# Altium project Discharge_circuit.PrjPcb
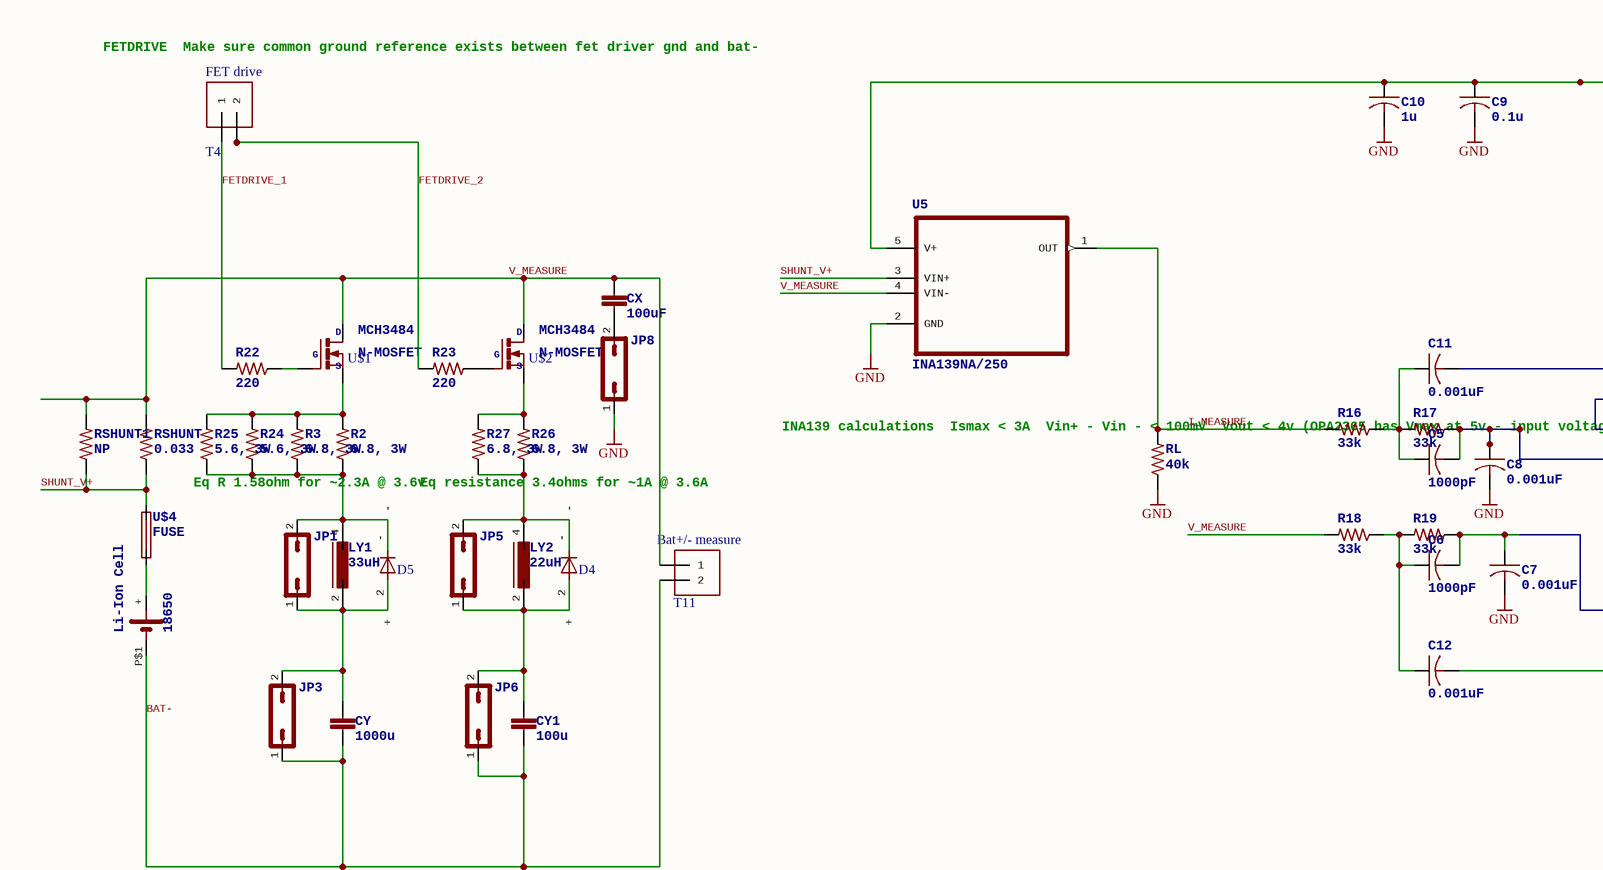
[diagram p0: Discharge_circuit_0.SchDoc, left]
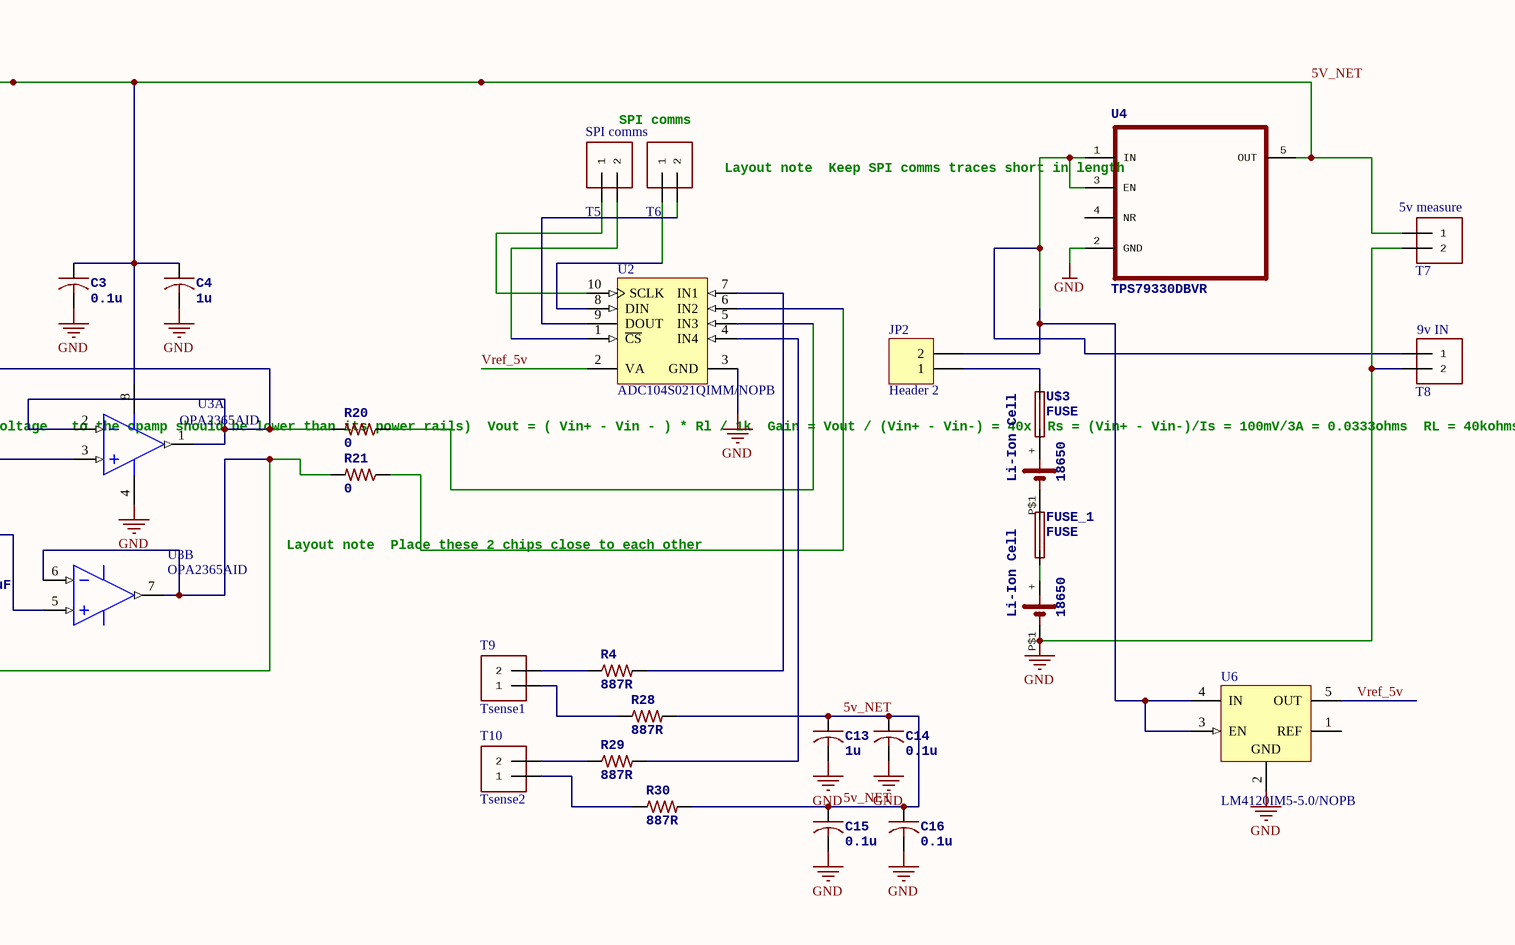
[diagram p1: Discharge_circuit_0.SchDoc, right]
2 sheets, 102 parts. Net scope: global (net labels, ports and power ports of the same name join across sheets).
Board file: Discharge_circuit.PcbDoc
Sheets:
  Discharge_circuit_0.SchDoc
  Discharge_circuit_1.SchDoc

## Sheet Discharge_circuit_0.SchDoc
size 524 x 157 mm

### Parts
C3  0.1u  [C1206]
C4  1u  [C1206]
C5  1000pF  [C1206]
C6  1000pF  [C1206]
C7  0.001uF  [C1206]
C8  0.001uF  [C1206]
C9  0.1u  [C1206]
C10  1u  [C1206]
C11  0.001uF  [C1206]
C12  0.001uF  [C1206]
C13  1u  [C1206]
C14  0.1u  [C1206]
C15  0.1u  [C1206]
C16  0.1u  [C1206]
CX  100uF  [C5B5]
CY  1000u  [C5B5]
CY1  100u  [C5B5]
D4  DIODEDIODE  [SOD323]  (value not drawn)
D5  DIODEDIODE  [SOD323]  (value not drawn)
DUT  Li-IonCell: Li-Ion Cell  [18650]
DUT1  Li-IonCell: Li-Ion Cell  [18650]
DUT2  Li-IonCell: Li-Ion Cell  [18650]
FUSE_1  FUSE  [R1206]
JP1  (no value)  [JP1]
JP2  Header 2  [HDR1X2]
JP3  (no value)  [JP1]
JP5  (no value)  [JP1]
JP6  (no value)  [JP1]
JP8  (no value)  [JP1]
LY1  33uH  [DSH01]
LY2  22uH  [DSH01]
R2  6.8, 3W  [R2512]
R3  6.8, 3W  [R2512]
R4  887R  [R1206]
R16  33k  [R1206]
R17  33k  [R1206]
R18  33k  [R1206]
R19  33k  [R1206]
R20  0  [R0603]
R21  0  [R0603]
R22  220  [R1206]
R23  220  [R1206]
R24  5.6, 3W  [R2512]
R25  5.6, 3W  [R2512]
R26  6.8, 3W  [R2512]
R27  6.8, 3W  [R2512]
R28  887R  [R1206]
R29  887R  [R1206]
R30  887R  [R1206]
RL  40k  [R1206]
RSHUNT  0.033  [R1206]
RSHUNT1  NP  [R5025]
T4  FET drive  [1X2-3.5MM]
T5  SPI comms  [1X2-3.5MM]
T6  (no value)  [1X2-3.5MM]
T7  5v measure  [1X2-3.5MM]
T8  9v IN  [1X2-3.5MM]
T9  Tsense1  [1X2-3.5MM]
T10  Tsense2  [1X2-3.5MM]
T11  Bat+/- measure  [1X2-3.5MM]
U2  ADC104S021QIMM/NOPB  [TI-DGS10_N]
U3  OPA2365AID  [TI-D8_N]  (parts A,B of 2)
U4  TPS79330DBVR  [SOT95P280X145-5N]
U5  INA139NA/250  [SOT95P280X145-5N]
U6  LM4120IM5-5.0/NOPB  [MF05A_N]
U$1  MCH3484  [SOT23B-3]
U$2  MCH3484  [SOT23B-3]
U$3  FUSE  [R1206]
U$4  FUSE  [R1206]

### Nets
GND: C3.2 C4.2 C7.2 C8.2 C9.2 C10.2 C13.2 C14.2 C15.2 C16.2 DUT2.P$1(-) JP8.1 RL.1 T7.2 T8.2 U2.3(GND) U3.4(V-) U4.2(GND) U5.2(GND) U6.2(GND)
5V_NET: C3.1 C4.1 C9.1 C10.1 C13.1 C14.1 C15.1 C16.1 R28.2 R30.2 T7.1 U3.8(V+) U4.5(OUT) U5.5(V+)
BAT-: CY.2 CY1.2 DUT.P$1(-) JP3.1 JP6.1 T11.2
FETDRIVE_1: R22.2 T4.1
FETDRIVE_2: R23.2 T4.2
I_MEASURE: R16.2 RL.2 U5.1(OUT)
SHUNT_V+: RSHUNT.1 RSHUNT1.1 U5.3(VIN+) U$4.2
V_MEASURE: CX.1 R18.2 RSHUNT.2 RSHUNT1.2 T11.1 U5.4(VIN-) U$1.3(D) U$2.3(D)
Vref_5v: U2.2(VA) U6.5(OUT)
NetC5_1: C5.1 C11.1 R16.1 R17.2
NetC5_2: C5.2 C8.1 R17.1 U3.3(IN_A+)
NetC6_1: C6.1 C12.1 R18.1 R19.2
NetC6_2: C6.2 C7.1 R19.1 U3.5(IN_B+)
NetC11_2: C11.2 R20.2 U3.1(VOUT_A) U3.2(IN_A-)
NetC12_2: C12.2 R21.2 U3.6(IN_B-) U3.7(VOUT_B)
NetCX_2: CX.2 JP8.2
NetCY1_1: CY1.1 D4.2(+) JP5.1 JP6.2 LY2.2
NetCY_1: CY.1 D5.2(+) JP1.1 JP3.2 LY1.2
NetD4_-: D4.- JP5.2 LY2.4 R26.1 R27.1
NetD5_-: D5.- JP1.2 LY1.4 R2.1 R3.1 R24.1 R25.1
NetDUT1_+: DUT1.+ U$3.1
NetDUT1_P$1: DUT1.P$1(-) FUSE_1.2
NetDUT2_+: DUT2.+ FUSE_1.1
NetDUT_+: DUT.+ U$4.1
NetJP2_1: JP2.1 U$3.2
NetJP2_2: JP2.2 T8.1 U4.1(IN) U4.3(EN) U6.3(EN) U6.4(IN)
NetR2_2: R2.2 R3.2 R24.2 R25.2 U$1.2(SG1)
NetR4_1: R4.1 T9.2
NetR4_2: R4.2 U2.7(IN1)
NetR20_1: R20.1 U2.5(IN3)
NetR21_1: R21.1 U2.6(IN2)
NetR22_1: R22.1 U$1.1(G)
NetR23_1: R23.1 U$2.1(G)
NetR26_2: R26.2 R27.2 U$2.2(SG1)
NetR28_1: R28.1 T9.1
NetR29_1: R29.1 T10.2
NetR29_2: R29.2 U2.4(IN4)
NetR30_1: R30.1 T10.1
NetT5_1: T5.1 U2.10(SCLK)
NetT5_2: T5.2 U2.1(~{CS})
NetT6_1: T6.1 U2.8(DIN)
NetT6_2: T6.2 U2.9(DOUT)

Not connected (* = marked no-connect by the designer): U4 4(NR); U6 1(REF)

### Notes on the sheet
- (near T4) FETDRIVE
  Make sure common ground reference exists between fet driver gnd and bat-
- SPI comms
- Layout note
  Keep SPI comms traces short in length
- INA139 calculations
  Ismax < 3A
  Vin+ - Vin - < 100mV
  Vout < 4v (OPA2365 has Vmax at 5v - input voltage
  to the opamp should be lower than its power rails)
  Vout = ( Vin+ - Vin - ) * Rl / 1k
  Gain = Vout / (Vin+ - Vin-) = 40x
  Rs = (Vin+ - Vin-)/Is = 100mV/3A = 0.0333ohms
  RL = 40kohms for 40x gain
- Eq R 1.58ohm for ~2.3A @ 3.6v
- Eq resistance 3.4ohms for ~1A @ 3.6A
- Layout note
  Place these 2 chips close to each other

### Library data of the parts
C3-C16 = C-USC1206: CAPACITOR, American symbol
CX CY CY1 = C5/5: CAPACITOR   naming: grid - package width
D4 D5 = DIODEDIODE: http://www.digikey.com/product-detail/en/panasonic-electronic-components/MA2Z0300AL/MA2Z0300ALCT-ND/972523
DUT DUT1 DUT2 = 18650_CELL: 18650: 18650
JP1 JP3 JP5 JP6 JP8 = JP1Q: JUMPER
JP2 = Header 2: Header, 2-Pin; LatestRevisionDate: 17-Jul-2002; LatestRevisionNote: Re-released for DXP Platform.; Publisher: Altium Limited
LY1 LY2 = DSH01: INDUCTOR
R2 R3 R24-R27 = R-US_R2512: RESISTOR, American symbol
R4 R28-R30 = R-US_R1206
R16-R23 RL RSHUNT = R-US_R1206: RESISTOR, American symbol
RSHUNT1 = R-US_R5025: RESISTOR, American symbol
T4-T8 T11 = 1X2-3.5MM: 3.5mm Terminal block    http://www.ladyada.net/library/pcb/eaglelibrary.html
T9 T10 = 1X2-3.5MM
U2 = ADC104S021QIMM/NOPB: 4 Channel, 50 to 200 kSPS, 10-Bit ADC, -40 to 85 degC, 10-pin SOP (DGS10), Green (RoHS & no Sb/Br); Manufacturer: Texas Instruments; # Input Channels: 4; Analog Voltage AV/DD(Max)(V): 5.25; Analog Voltage AV/DD(Min)(V): 2.7; Architecture: SAR; ENOB(Bits): 9.9; INL(Max)(+/-LSB): 0.3; Interface: Serial SPI, QSPI, Microwire (Serial I/O); Resolution(Bits): 10; Sample Rate(max)(SPS): 200k; SFDR(dB): 82; SINAD(dB): 61.8; SubFamily: Precision ADC (<=10MSPS); DatasheetVersion: SNAS278H; PackageVersion: 4073272/C, 02/2004; PackageReference: DGS10; PackageDescription: 10-Pin Plastic Small Outline, Body 3 x 3 mm, Pitch 0.5 mm; Supplier 1: Digi-Key; Supplier Part Number 1: 296-19307-2-ND; Supplier 2: Digi-Key; Supplier Part Number 2: 296-19307-1-ND; Supplier 3: Digi-Key; Supplier Part Number 3: 296-19307-6-ND; Supplier 4: Farnell; Supplier Part Number 4: 1838857; Supplier 5: Newark; Supplier Part Number 5: 66K0602; Supplier 6: Mouser; Supplier Part Number 6: 595-ADS7886SDBVT; Digital Supply(Max)(V): 5.25; Digital Supply(Min)(V): 2.7; Eco-Plan: Green (RoHS & no Sb/Br); SNR(dB): 61.8; Mounting Technology: Surface Mount; Code_JEDEC: MO-153; PartNumber: ADC104S021QIMM/NOPB; ComponentLink1Description: Manufacturer URL; ComponentLink1URL: http://www.ti.com/; ComponentLink2Description: Datasheet; ComponentLink2URL: http://www.ti.com/lit/ds/symlink/adc104s021q-q1.pdf; ComponentLink3Description: Package Specification; ComponentLink3URL: http://www.ti.com/lit/ml/mpds035b/mpds035b.pdf
U3 = OPA2365AID: 50 MHz, Low-Noise Single-Supply Rail-to-Rail Operational Amplifier, 2.2 to 5.5 V, -40 to 125 degC, 8-pin SOIC (D8), Green (RoHS & no Sb/Br); Manufacturer: Texas Instruments; CMRR(Min)(dB): 100; IIB(Max)(pA): 10; Iq per channel(Max)(mA): 5; Number of Channels: 2; Offset Drift(Typ)(uV/C): 1; Slew Rate(Typ)(V/us): 25; Sub Family: High Speed Amplifier (>=50MHz), Low Input Bias Current Amp (<=10pA), Low Offset Voltage Amplifier (<=500uV), Low Supply Voltage Amplifier (<=2.7V); Total Supply Voltage(Max)(+5V is 5, +/-5V is 10): 5.5; Total Supply Voltage(Min)(+5V is 5, +/-5V is 10): 2.2; Vio (25C)(Max)(mV): 0.2; DatasheetVersion: SBOS365D; PackageVersion: 4040047-3/M, 06/2011; PackageReference: D8; PackageDescription: 8-Pin Plastic Small Outline, Body 4.9 x 3.9 mm, Pitch 1.27 mm; Supplier 1: Digi-Key; Supplier Part Number 1: 296-20801-ND; Supplier 2: Farnell; Supplier Part Number 2: 1363691; Supplier 3: Newark; Supplier Part Number 3: 18M7498; Supplier 4: Mouser; Supplier Part Number 4: 595-OPA2365AID; Eco-Plan: Green (RoHS & no Sb/Br); Mounting Technology: Surface Mount; Code_JEDEC: MS-012; PartNumber: OPA2365AID; ComponentLink1Description: Manufacturer URL; ComponentLink1URL: http://www.ti.com/; ComponentLink2Description: Datasheet; ComponentLink2URL: http://www.ti.com/general/docs/lit/getliterature.tsp?genericPartNumber=OPA2365&fileType=pdf; ComponentLink3Description: Package Specification; ComponentLink3URL: http://www.ti.com/litv/pdf/msoi002j
U4 = TPS79330DBVR: ULTRALOW-NOISE, HIGH PSRR, FAST RF 200mA LOW-DROPOUT LINEAR REGULATORS IN NanoStar? WAFER CHIP SCALE AND SOT23; MPN: TPS79330DBVR; OC_FARNELL: 1535767; OC_NEWARK: 77C1364; PACKAGE: SOT-23-5; SUPPLIER: Texas Instruments
U5 = INA139NA/250: High-Side Measurement CURRENT SHUNT MONITOR; MPN: INA139NA/250; OC_FARNELL: 1470398; OC_NEWARK: 39C3949; PACKAGE: SOT-23-5; SUPPLIER: Texas Instruments
U6 = LM4120IM5-5.0/NOPB: Precision Micropower Low Dropout Voltage Reference, 5-pin SOT-23, Pb-Free; Manufacturer: National Semiconductor; PackageTopMarking: R18B*XTT; PowerWise: Y; CompType: Voltage Reference IC; DatasheetVersion: Mar-2005; PackageVersion: revD, Aug-2008; PackageReference: MF05A; PackageDescription: Molded SOT-23, .115 x .063 x .040 in Body, 5 Lead, .0375 in Pitch; PartNumber: LM4120IM5-5.0/NOPB; RoHS: Y; PinCount: 5; ComponentLink1Description: Manufacturer URL; ComponentLink1URL: http://www.national.com/; ComponentLink2Description: LM4120 Datasheet; ComponentLink2URL: http://www.national.com/ds/LM/LM4120.pdf; ComponentLink3Description: LM4120 Web Page; ComponentLink3URL: http://www.national.com/pf/LM/LM4120.html; ComponentLink4Description: MF05A Package Page; ComponentLink4URL: http://www.national.com/packaging/folders/mf05a.html
U$1 U$2 = MCH3484: MCH3484 Power MOSFET 20v, 4.5A ON Semi http://www.onsemi.com/pub_link/Collateral/MCH3484-D.PDF; MCH3484: MCH3484; N-MOSFET: N-MOSFET; D: D; S: S; G: G

## Sheet Discharge_circuit_1.SchDoc
size 246 x 129 mm
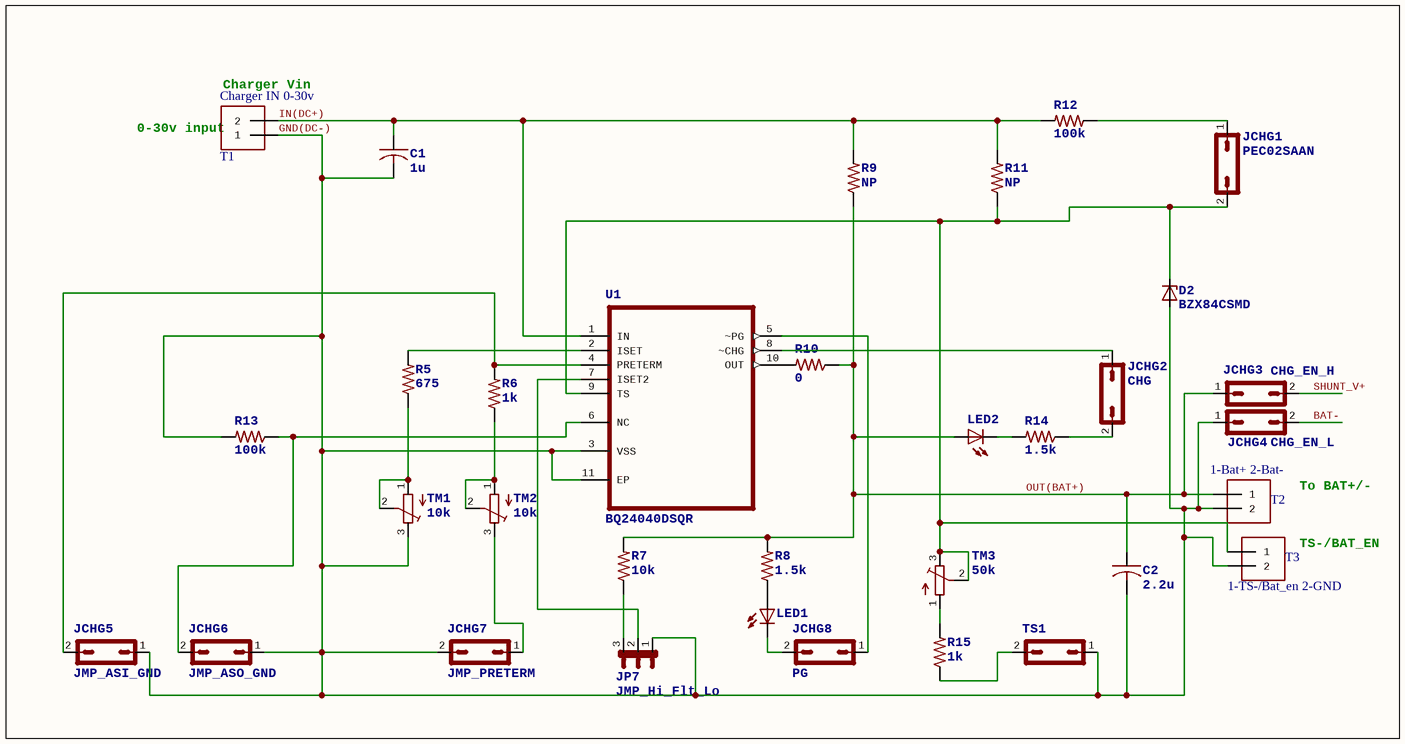
[diagram p2: Discharge_circuit_1.SchDoc]

### Parts
C1  1u  [C1206]
C2  2.2u  [C1206]
D2  BZX84CSMD  [TO236]
JCHG1  PEC02SAAN  [JP1]
JCHG2  CHG  [JP1]
JCHG3  CHG_EN_H  [JP1]
JCHG4  CHG_EN_L  [JP1]
JCHG5  JMP_ASI_GND  [JP1]
JCHG6  JMP_ASO_GND  [JP1]
JCHG7  JMP_PRETERM  [JP1]
JCHG8  PG  [JP1]
JP7  JMP_Hi_Flt_Lo  [JP2]
LED1  (no value)  [CHIPLED_1206]
LED2  (no value)  [CHIPLED_1206]
R5  675  [R1206]
R6  1k  [R1206]
R7  10k  [R1206]
R8  1.5k  [R1206]
R9  NP  [R1206]
R10  0  [R0603]
R11  NP  [R1206]
R12  100k  [R1206]
R13  100k  [R1206]
R14  1.5k  [R1206]
R15  1k  [R1206]
T1  Charger IN 0-30v  [1X2-3.5MM]
T2  1-Bat+ 2-Bat-  [1X2-3.5MM]
T3  1-TS-/Bat_en 2-GND  [1X2-3.5MM]
TM1  10k  [TC33X]
TM2  10k  [TC33X]
TM3  50k  [TC33X]
TS1  (no value)  [JP1]
U1  BQ24040DSQR  [SON40P200X200X80-10N]

### Nets
BAT-: JCHG4.2
GND(DC-): C1.2 C2.2 D2.A JCHG4.1 JCHG5.1 JCHG6.1 JCHG7.2 JP7.1 R13.2 T1.1 T2.2 T3.2 TM1.3(E) TS1.1 U1.3(VSS) U1.11(EP)
IN(DC+): C1.1 R9.2 R11.2 R12.2 T1.2 U1.1(IN)
OUT(BAT+): C2.1 JCHG3.1 LED2.A R7.2 R8.2 R9.1 R10.1 T2.1
SHUNT_V+: JCHG3.2
NetD2_C: D2.C JCHG1.2 R11.1 T3.1 TM3.2(S) TM3.3(E) U1.9(TS)
NetJCHG1_1: JCHG1.1 R12.1
NetJCHG2_1: JCHG2.1 U1.8(~CHG)
NetJCHG2_2: JCHG2.2 R14.1
NetJCHG5_2: JCHG5.2 R6.2 U1.4(PRETERM)
NetJCHG6_2: JCHG6.2 R13.1 U1.6(NC)
NetJCHG7_1: JCHG7.1 TM2.3(E)
NetJCHG8_1: JCHG8.1 U1.5(~PG)
NetJCHG8_2: JCHG8.2 LED1.C
NetJP7_2: JP7.2 U1.7(ISET2)
NetJP7_3: JP7.3 R7.1
NetLED1_A: LED1.A R8.1
NetLED2_C: LED2.C R14.2
NetR5_1: R5.1 TM1.1(A) TM1.2(S)
NetR5_2: R5.2 U1.2(ISET)
NetR6_1: R6.1 TM2.1(A) TM2.2(S)
NetR10_2: R10.2 U1.10(OUT)
NetR15_1: R15.1 TS1.2
NetR15_2: R15.2 TM3.1(A)

### Notes on the sheet
- (near T1) Charger Vin
- (near T1) 0-30v input
- To BAT+/-
- TS-/BAT_EN

### Library data of the parts
C1 C2 = C-USC1206: CAPACITOR, American symbol
D2 = BZX84CSMD: Z DIODE
JCHG1-JCHG8 TS1 = JP1Q: JUMPER
JP7 = JP2E: JUMPER
LED1 LED2 = LEDCHIPLED_1206: LED   OSRAM: - CHIPLED LG R971, LG N971, LY N971, LG Q971, LY Q971, LO R971, LY R971 LH N974, LH R974 LS Q976, LO Q976, LY Q976 LO Q996 - Hyper CHIPLED LW Q18S LB Q993, LB Q99A, LB R99A - SideLED LS A670, LO A670, LY A670, LG A670, LP A670 LB A673, LV A673, LT A673, LW A673 LH A674 LY A675 LS A676, LA A676, LO A676, LY A676, LW A676 LS A679, LY A679, LG A679 -  Hyper Micro SIDELED® LS Y876, LA Y876, LO Y876, LY Y876 LT Y87S - SmartLED LW L88C, LW L88S LB L89C, LB L89S, LG L890 LS L89K, LO L89K, LY L89K LS L896, LA L896, LO L896, LY L896 - TOPLED LS T670, LO T670, LY T670, LG T670, LP T670 LSG T670, LSP T670, LSY T670, LOP T670, LYG T670 LG T671, LOG T671, LSG T671 LB T673, LV T673, LT T673, LW T673 LH T674 LS T676, LA T676, LO T676, LY T676, LB T676, LH T676, LSB T676, LW T676 LB T67C, LV T67C, LT T67C, LS T67K, LO T67K, LY T67K, LW E67C LS E67B, LA E67B, LO E67B, LY E67B, LB E67C, LV E67C, LT E67C LW T67C LS T679, LY T679, LG T679 LS T770, LO T770, LY T770, LG T770, LP T770 LB T773, LV T773, LT T773, LW T773 LH T774 LS E675, LA E675, LY E675, LS T675 LS T776, LA T776, LO T776, LY T776, LB T776 LHGB T686 LT T68C, LB T68C - Hyper Mini TOPLED® LB M676 - Mini TOPLED Santana® LG M470 LS M47K, LO M47K, LY M47K    Source: http://www.osram.convergy.de/
R5-R15 = R-US_R1206: RESISTOR, American symbol
T1-T3 = 1X2-3.5MM: as T4 on sheet Discharge_circuit_0
TM1-TM3 = TRIMPOTTC33X: SMT trimmer potentiometer part number TC33X    http://www.ladyada.net/library/eagle
U1 = BQ24040DSQR: Single Cell Li-Ion Battery Charger; MPN: BQ24040DSQR; OC_FARNELL: -; OC_NEWARK: 50R7512; PACKAGE: SON-10; SUPPLIER: Texas Instruments

## Nets that join several sheets
BAT-: Discharge_circuit_0 (6 pins), Discharge_circuit_1 (JCHG4.2)
SHUNT_V+: Discharge_circuit_0 (RSHUNT.1 RSHUNT1.1 U5.3 U$4.2), Discharge_circuit_1 (JCHG3.2)